# Altium schematic sheet Channel.SchDoc
size A; SheetNumber: 1; SheetTotal: 4
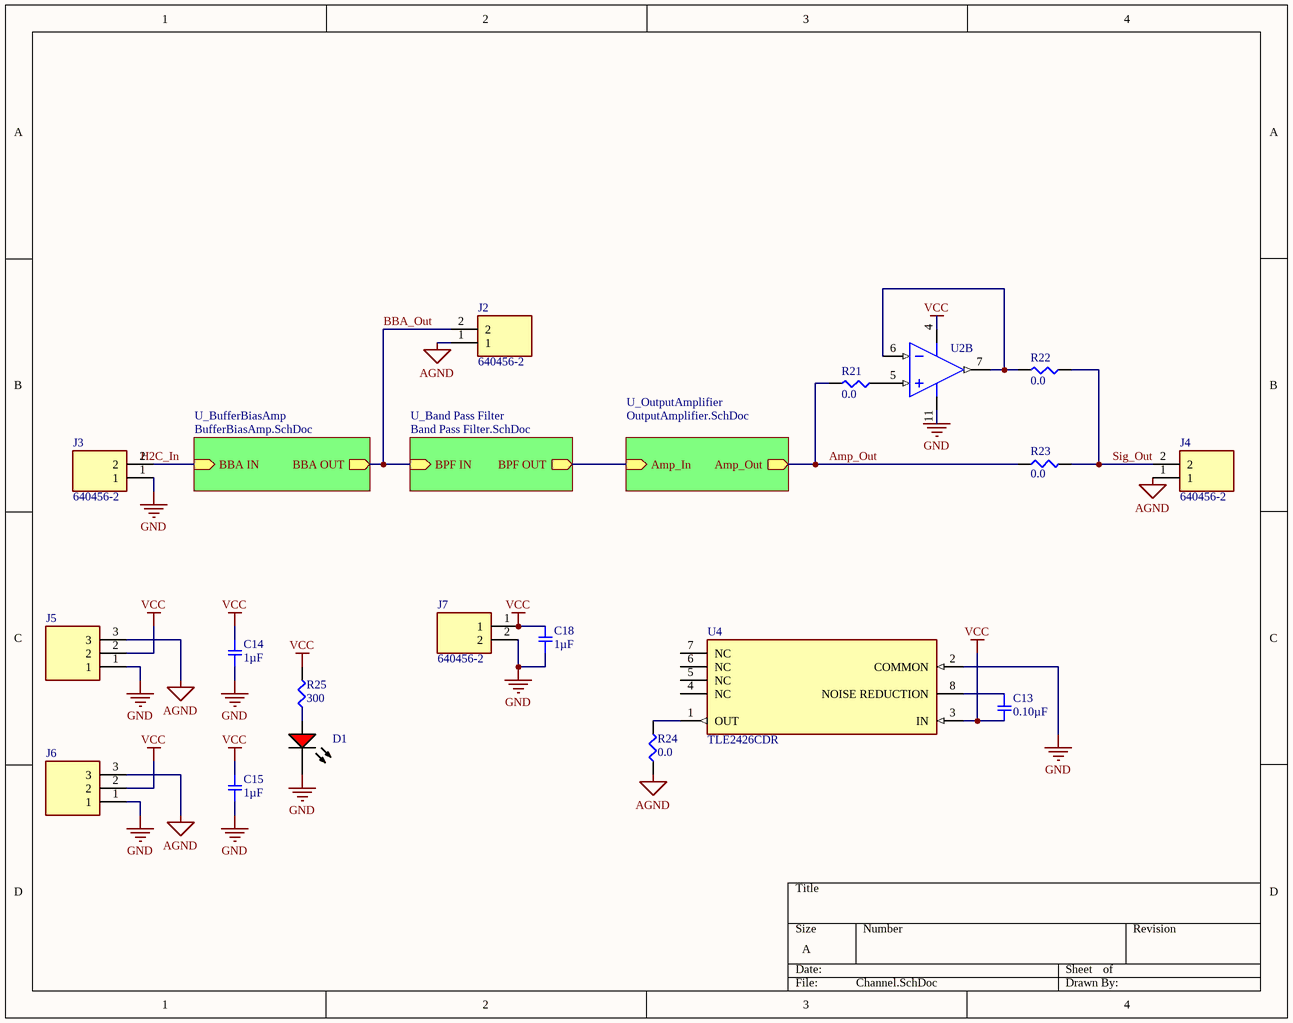
[diagram p0: Channel.SchDoc]

## Parts
C13  0.10µF  [SMD-0603C]
C14  1µF  [SMD-0603C]
C15  1µF  [SMD-0603C]
C18  1µF  [SMD-0603C]
D1  TLMS1100-GS08  [VISH-TLMX1100_V]  (value not drawn)
J2  640456-2  [TE_640456-2]
J3  640456-2  [TE_640456-2]
J4  640456-2  [TE_640456-2]
J5  TSW-103-07-L-S  [TSW-103-XX-YY-S]  (value not drawn)
J6  TSW-103-07-L-S  [TSW-103-XX-YY-S]  (value not drawn)
J7  640456-2  [TE_640456-2]
R21  0.0  [SMD-0603-RES]
R22  0.0  [SMD-0603-RES]
R23  0.0  [SMD-0603-RES]
R24  0.0  [SMD-0603-RES]
R25  300  [SMD-0603-RES]
U2  OPA1604AIPWR  [PW0014A_N]  (value not drawn)  (part B of 4)
U4  TLE2426CDR  [FP-D0008A-IPC_B]

## Sub-sheets
U_Band Pass Filter = Band Pass Filter.SchDoc: BPF IN (in), BPF OUT (out)
U_BufferBiasAmp = BufferBiasAmp.SchDoc: BBA IN (in), BBA OUT (out)
U_OutputAmplifier = OutputAmplifier.SchDoc: Amp_In (in), Amp_Out (out)

## Nets
AGND: J2.1 J4.1 J5.3 J6.3 R24.1
GND: C14.1 C15.1 C18.1 D1.2(K) J3.1 J5.1 J6.1 J7.2 U2.11(V-) U4.2(COMMON)
VCC: C13.2 C14.2 C15.2 C18.2 J5.2 J6.2 J7.1 R25.2 U2.4(V+) U4.3(IN)
Amp_Out: R21.2 R23.1 ; sheet U_OutputAmplifier/Amp_Out
BBA_Out: J2.2 ; sheet U_Band Pass Filter/BPF IN, sheet U_BufferBiasAmp/BBA OUT
Sig_Out: J4.2 R22.1 R23.2
NetC13_1: C13.1 U4.8(NOISE_REDUCTION)
NetD1_1: D1.1(A) R25.1
NetJ3_2: J3.2 ; sheet U_BufferBiasAmp/BBA IN
NetR21_1: R21.1 U2.5(IN_B+)
NetR22_2: R22.2 U2.6(IN_B-) U2.7(OUT_B)
NetR24_2: R24.2 U4.1(OUT)
(unnamed): sheet U_OutputAmplifier/Amp_In, sheet U_Band Pass Filter/BPF OUT

Not connected (* = marked no-connect by the designer): U4 4(NC) 5(NC) 6(NC) 7(NC)

## Notes on the sheet
- Labels drawn without touching a wire or pin: H2C_In

## Library data of the parts
C13 = GCJ188R71C104KA01D: CAP CER 0.1UF 16V X7R 0603; Manufacturer: Samsung Electro-Mechanics; Manufacturer Part Number: CL10B104KB8NNWC; Value: 0.10µF; Operating Temperature: -55°C ~ 125°C; Package / Case: 0603 (1608 Metric); Datasheet Link: https://www.digikey.com/en/products/detail/samsung-electro-mechanics/CL10B104KB8NNWC/3887593
C14 C15 C18 = GCM188R71C105KA64D: CAP CER 1UF 16V X7R 0603; Manufacturer: Samsung Electro-Mechanics; Manufacturer Part Number: CL10A105KA8NNNC; Value: 1µF; Operating Temperature: -55°C ~ 125°C; Package / Case: 0603 (1608 Metric); Datasheet Link: https://www.digikey.com/en/products/detail/samsung-electro-mechanics/CL10A105KA8NNNC/3886760
D1 = CMP-1666-00027-1: LED, RED, 2.1 V, -40 to 100 degC, 2-Pin SMD (0603), RoHS, Tape and Reel; Manufacturer: Wurth Elektronics; Manufacturer Part Number: 150080SS75000; Value: 1.9V; Datasheet Link: https://www.mouser.com/ProductDetail/Wurth-Elektronik/150080SS75000?qs=LlUlMxKIyB2zzpiaOzrUdw%3D%3D&mgh=1&gclid=Cj0KCQjwm6KUBhC3ARIsACIwxBhChbj4MsdASq_HKZ9IIHp_SBsI6cWeNQVHWnPWPX4ZaUjtoXFUdFUaAm30EALw_wcB; Operating Temperature: -40to85degC; Package / Case: 0805 (2012 Metric); RoHS: Pb-Free
J2 J4 J7 = 640456-2: Connector Header Through Hole 2 position 0.100 _2.54mm_; MF: TE Connectivity; Package: None; Availability: Unavailable; TE_purchase_URL: https://www.te.com/usa-en/product-640456-2.html?te_bu=Cor&te_type=disp&te_campaign=seda_glo_cor-seda-global-disp-prtnr-fy19-seda-model-bom-cta_sma-317_1&elqCampaignId=32493; MP: 640456-2; Value: *; EU_RoHS_Compliance: Compliant; SnapEDA_Link: https://www.snapeda.com/parts/640456-2/TE%20Connectivity%20AMP%20Connectors/view-part/1957547/?ref=snap; Price: None
J3 = 640456-2: Connector Header Through Hole 2 position 0.100 _2.54mm_ Keyed; MF: TE Connectivity; Package: None; Availability: Unavailable; TE_purchase_URL: https://www.te.com/usa-en/product-640456-2.html?te_bu=Cor&te_type=disp&te_campaign=seda_glo_cor-seda-global-disp-prtnr-fy19-seda-model-bom-cta_sma-317_1&elqCampaignId=32493; MP: 640456-2; Value: *; EU_RoHS_Compliance: Compliant; SnapEDA_Link: https://www.snapeda.com/parts/640456-2/TE%20Connectivity%20AMP%20Connectors/view-part/1957547/?ref=snap; Price: None
J5 J6 = TSW-103-07-L-S: 1x3 2.54" pitch; Manufacturer_Name: SAMTEC; Datasheet Link: http://suddendocs.samtec.com/prints/tsw-xxx-xx-xxx-x-xx-xxx-mkt.pdf; Manufacturer_Part_Number: TSW-103-07-L-S
R21-R24 = ERJ-3GEY0R00V: RES SMD 0.0OHM JUMPER 1/10W 0603; Manufacturer: Stackpole Electronics Inc; Manufacturer Part Number: RMCF0603ZT0R00; Value: 0.0; Operating Temperature: -55°C ~ 155°C; Package / Case: 0603 (1608 Metric); Datasheet Link: https://www.digikey.com/en/products/detail/stackpole-electronics-inc/RMCF0603ZT0R00/1756908
R25 = ERJ-3EKF3000V: RES SMD 300 OHM 1% 1/10W 0603; Manufacturer: Panasonic Electronic Components; Value: 300; Operating Temperature: -55°C ~ 155°C; Package / Case: 0603 (1608 Metric); Datasheet Link: https://www.digikey.com/en/products/detail/panasonic-electronic-components/ERJ-3EKF3000V/1746363; Manufacturer Part Number: ERJ-3EKF3000V
U2 = CMP-0272-01731-3: Sound Plus High-Performance, Bipolar-Input Audio Operational Amplifier, 4.5 to 36 V, -40 to 85 degC, 14-pin SOP (PW14), Green (RoHS & no Sb/Br); Manufacturer: Texas Instruments; Datasheet Link: https://www.digikey.com/en/products/detail/texas-instruments/OPA1604AIPWR/2793768; Manufacturer Part Number: OPA1604AIPWR; Operating Temperature: -40°C ~ 85°C; Package / Case: 14-TSSOP
U4 = CMP-04916-000011-1: Ground Reference (Virtual) Voltage Reference IC Adjustable 2V 20 VV ±1% 20 mA 8-SOIC; Manufacturer: Texas Instruments; Manufacturer Part Number: TLE2426MD; Value: N/A; Operating Temperature: -55°C ~ 125°C; Datasheet Link: https://www.digikey.com/en/products/detail/texas-instruments/TLE2426MD/1676989; Package / Case: 8-SOIC